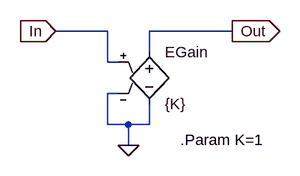
[diagram p0: schematic Gain.asc]
Gain.asc, the LTspice schematic file:
Version 4
SHEET 1 880 680
WIRE 128 80 48 80
WIRE 320 80 192 80
WIRE 192 112 192 80
WIRE 128 128 128 80
WIRE 144 128 128 128
WIRE 144 176 128 176
WIRE 128 224 128 176
WIRE 160 224 128 224
WIRE 192 224 192 192
WIRE 192 224 160 224
WIRE 160 256 160 224
FLAG 160 256 0
FLAG 48 80 In
IOPIN 48 80 In
FLAG 320 80 Out
IOPIN 320 80 Out
SYMBOL e 192 96 R0
SYMATTR InstName EGain
SYMATTR Value {K}
TEXT 240 248 Left 2 !.Param K=1

The netlist it stands for:
* Gain.asc
EGain Out 0 In 0 {K}
.Param K=1
.backanno
.end